# Altium project Arduino.PrjPcb (part 1 of 3)
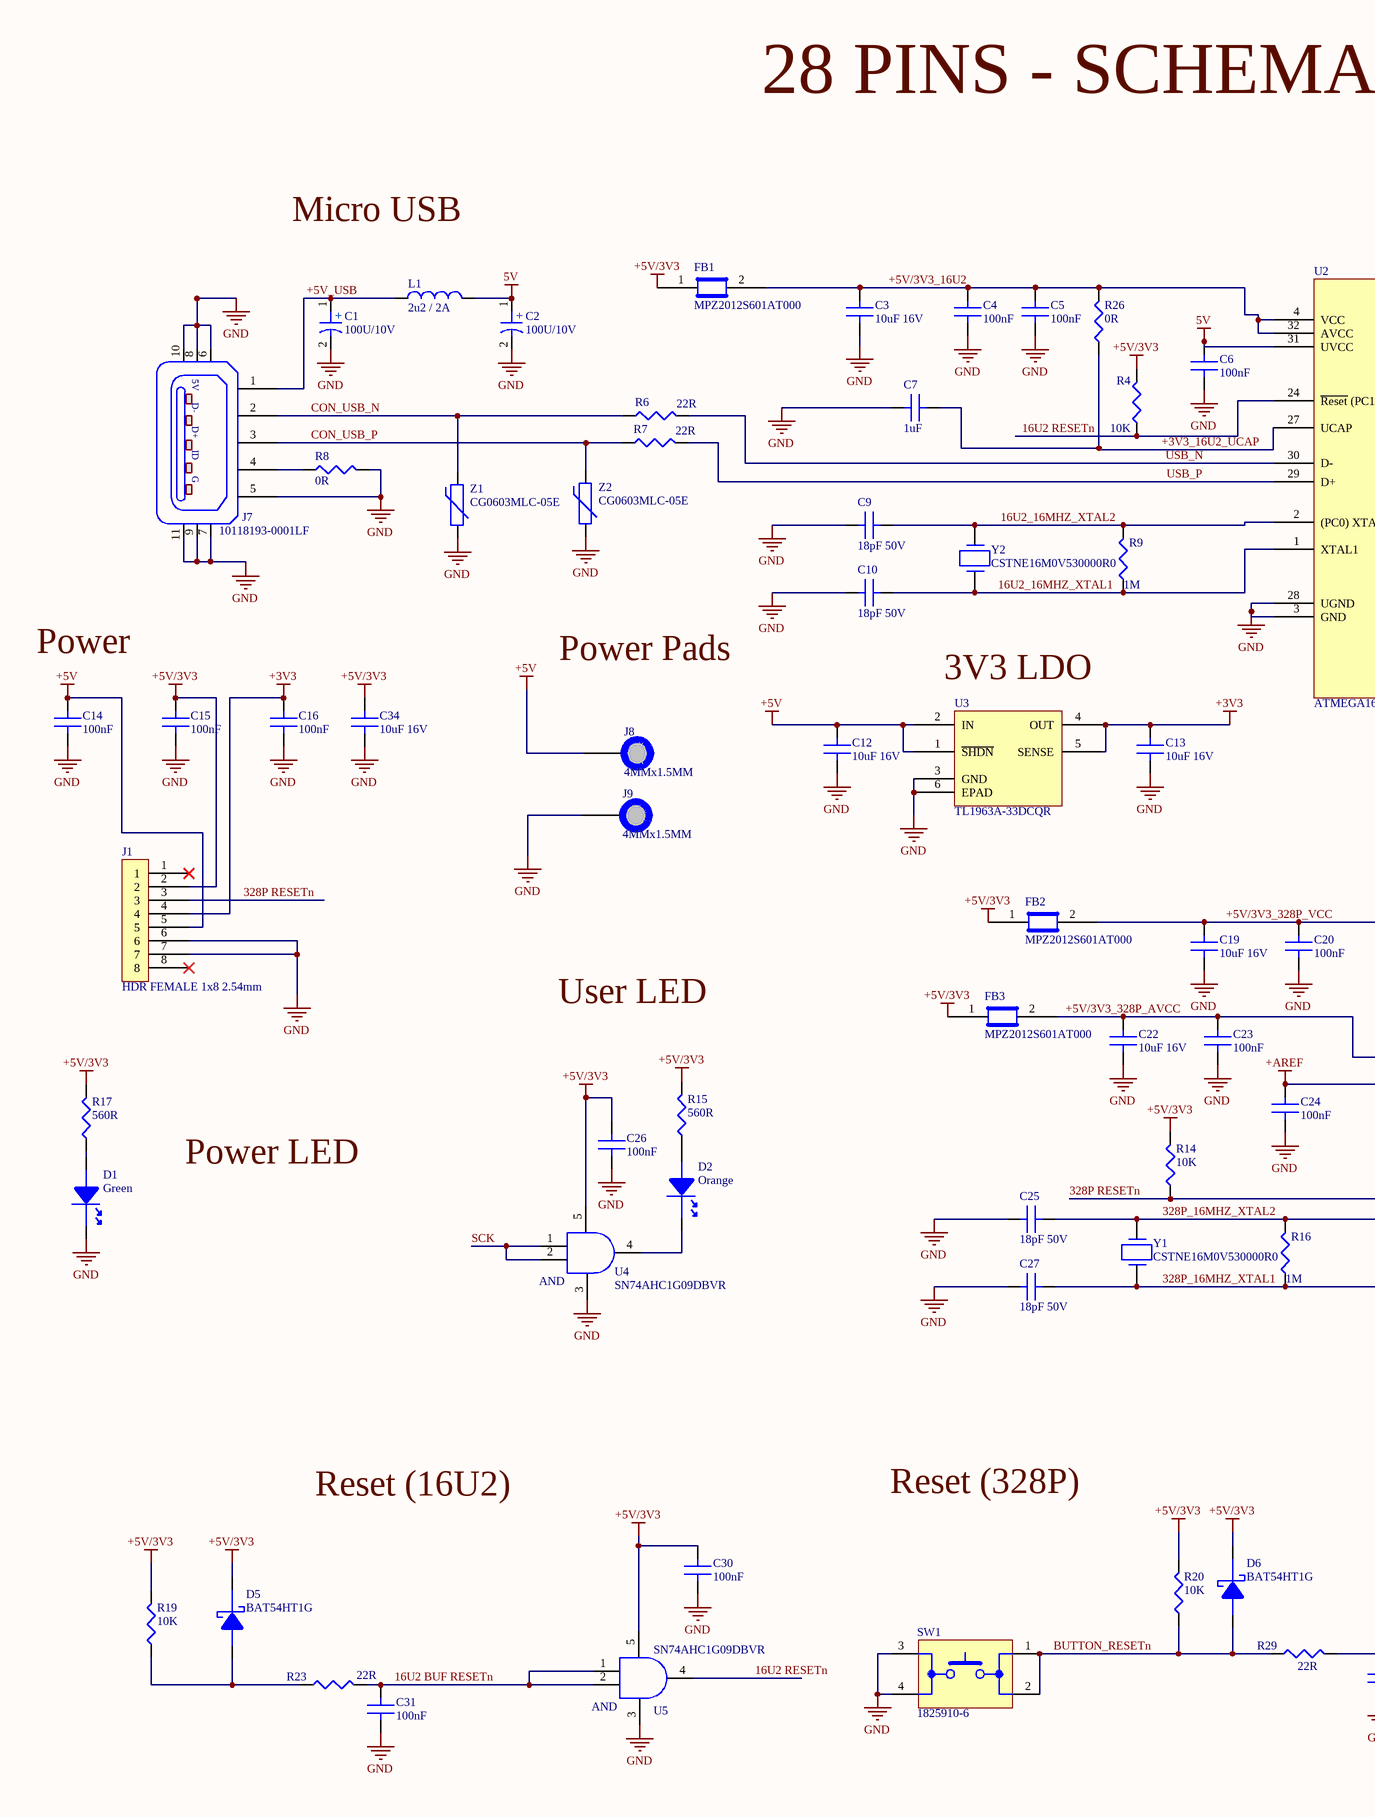
[diagram p0: Arduino_Schematic.SchDoc, left]
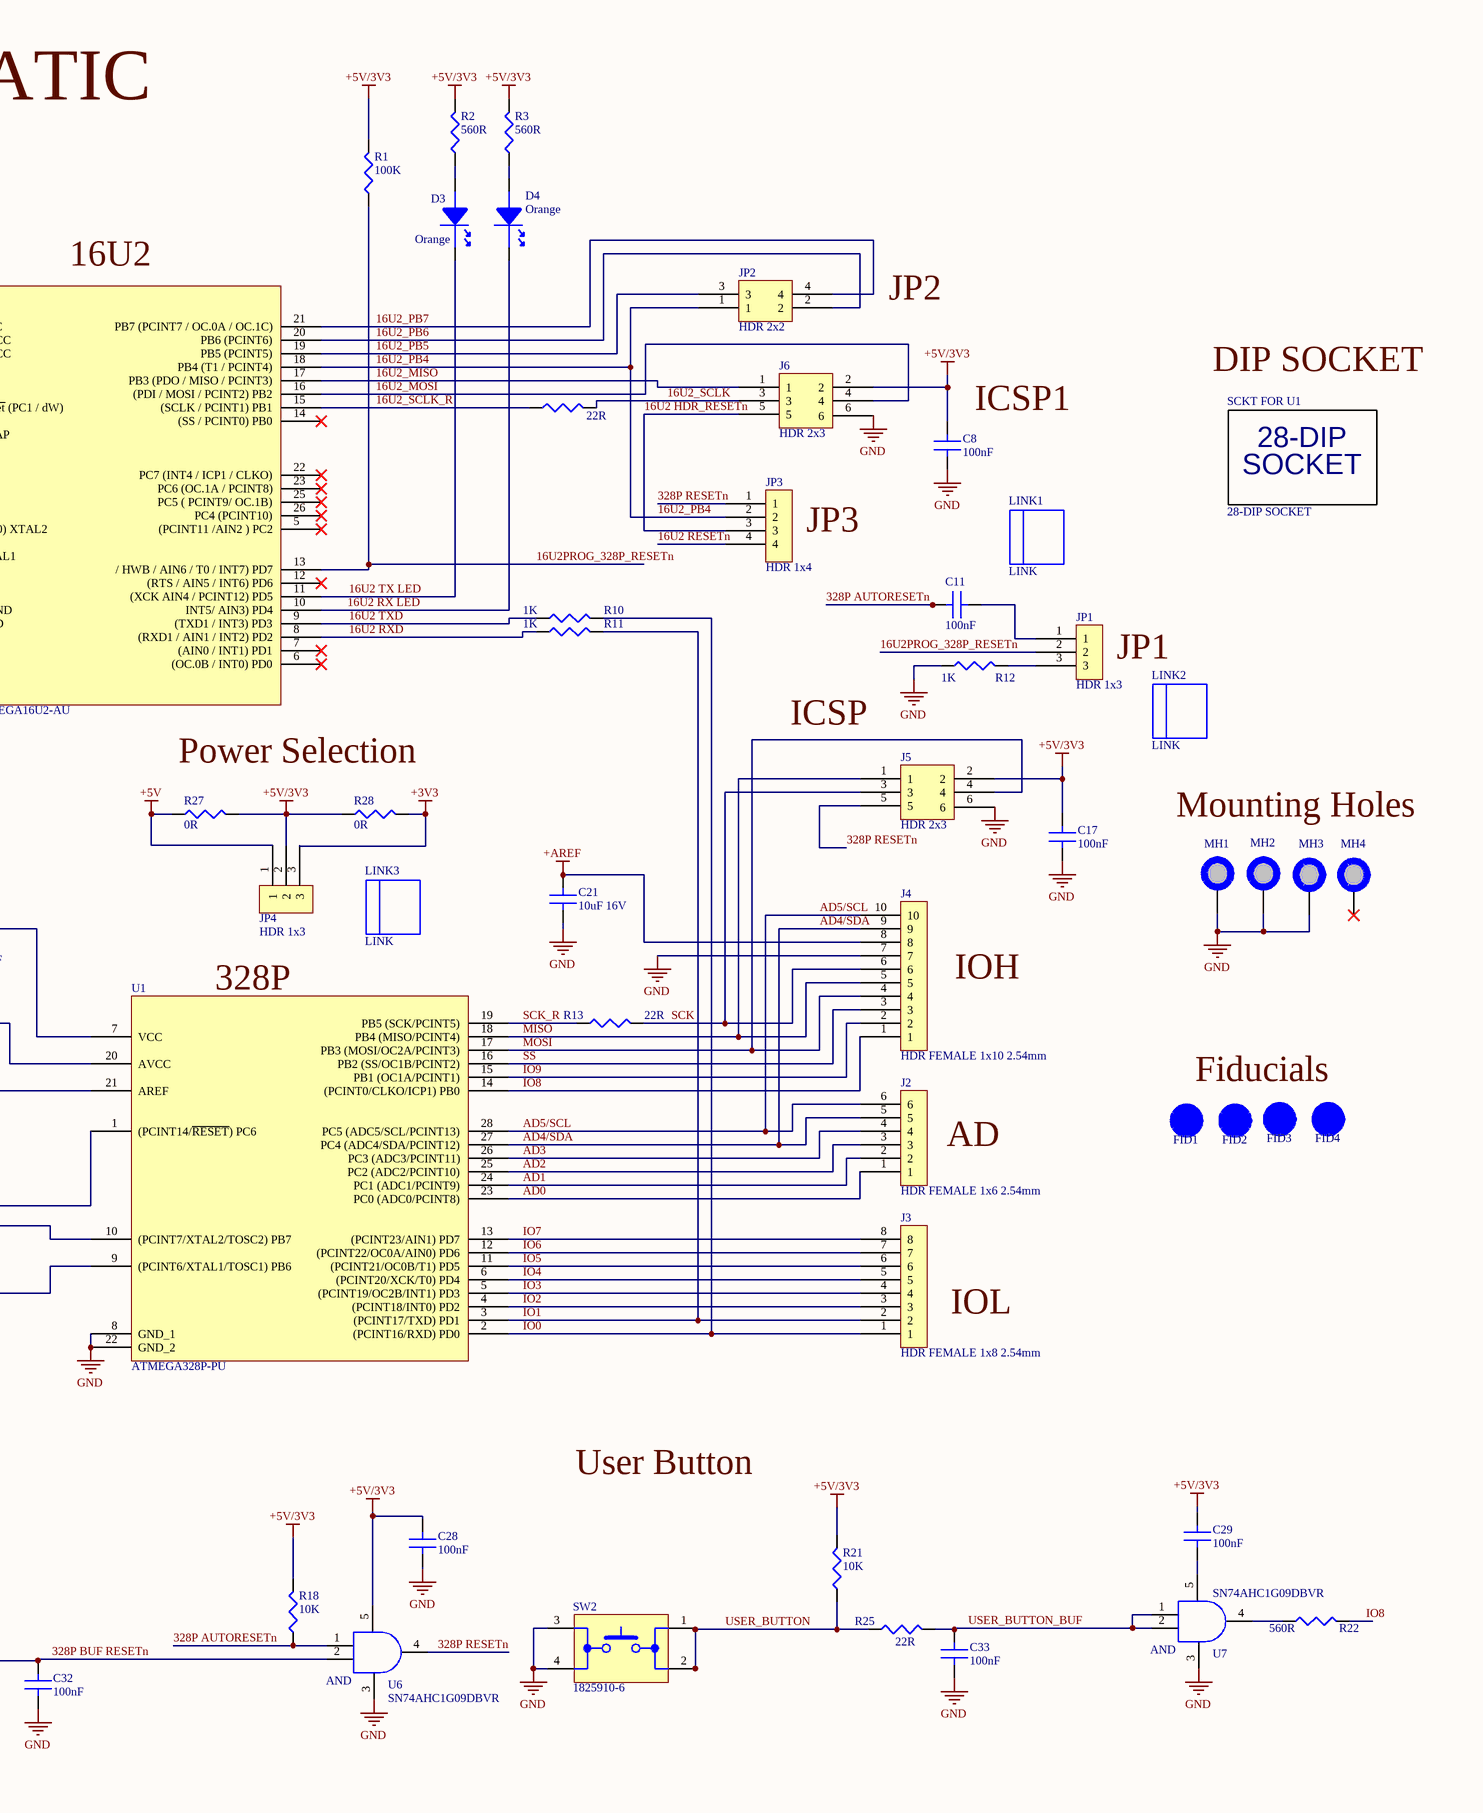
[diagram p1: Arduino_Schematic.SchDoc, right]
NotFitted: NF; Title: Arduino
1 sheet, 109 parts. Net scope: global (net labels, ports and power ports of the same name join across sheets).

## Sheet Arduino_Schematic.SchDoc: Arduino
size A2; SheetNumber: 1; SheetTotal: 1

### Parts
C1  100U/10V  [C_ALUE_C_SIZE]
C2  100U/10V  [C_ALUE_C_SIZE]
C3  10uF 16V  [C0805]
C4  100nF  [C0805]
C5  100nF  [C0805]
C6  100nF  [C0805]
C7  1uF  [C0805]
C8  100nF  [C0805]
C9  18pF 50V  [C0805]
C10  18pF 50V  [C0805]
C11  100nF  [C0805]
C12  10uF 16V  [C0805]
C13  10uF 16V  [C0805]
C14  100nF  [C0805]
C15  100nF  [C0805]
C16  100nF  [C0805]
C17  100nF  [C0805]
C19  10uF 16V  [C0805]
C20  100nF  [C0805]
C21  10uF 16V  [C0805]
C22  10uF 16V  [C0805]
C23  100nF  [C0805]
C24  100nF  [C0805]
C25  18pF 50V  [C0805]
C26  100nF  [C0805]
C27  18pF 50V  [C0805]
C28  100nF  [C0805]
C29  100nF  [C0805]
C30  100nF  [C0805]
C31  100nF  [C0805]
C32  100nF  [C0805]
C33  100nF  [C0805]
C34  10uF 16V  [C0805]
D1  Green  [LED_0603]
D2  Orange  [LED_0603]
D3  Orange  [LED_0603]
D4  Orange  [LED_0603]
D5  BAT54HT1G  [SOD323]
D6  BAT54HT1G  [SOD323]
FB1  MPZ2012S601AT000  [C0805]
FB2  MPZ2012S601AT000  [C0805]
FB3  MPZ2012S601AT000  [C0805]
FID1  FID_1MM  [FID_40x120D]  (value not drawn)  (no BOM)
FID2  FID_1MM  [FID_40x120D]  (value not drawn)  (no BOM)
FID3  FID_1MM  [FID_40x120D]  (value not drawn)  (no BOM)
FID4  FID_1MM  [FID_40x120D]  (value not drawn)  (no BOM)
J1  HDR FEMALE 1x8 2.54mm  [HDR_FEMALE_1x8_2.54]
J2  HDR FEMALE 1x6 2.54mm  [HDR_FEMALE_1x6_2.54]
J3  HDR FEMALE 1x8 2.54mm  [HDR_FEMALE_1x8_2.54]
J4  HDR FEMALE 1x10 2.54mm  [HDR_FEMALE_1x10_2.54]
J5  HDR 2x3  [HDR 2X3]
J6  HDR 2x3  [HDR 2X3]
J7  10118193-0001LF  [10118193]
J8  4MMx1.5MM  [PAD_WITH_HOLE_4MMx1.5MM]  (no BOM)
J9  4MMx1.5MM  [PAD_WITH_HOLE_4MMx1.5MM]  (no BOM)
JP1  HDR 1x3  [HDR_1x3_2.54]
JP2  HDR 2x2  [HDR 2X2_2.54MM]
JP3  HDR 1x4  [HDR_1x4_2.54]
JP4  HDR 1x3  [HDR_1x3_2.54]
L1  2u2 / 2A  [C1210_IND]
LINK1  LINK  (mechanical)
LINK2  LINK  (mechanical)
LINK3  LINK  (mechanical)
MH1  MH_7.4MMC_3.2MMD  [MH_7.4MMD_3.2MMD]  (value not drawn)  (no BOM)
MH2  MH_7.4MMC_3.2MMD  [MH_7.4MMD_3.2MMD]  (value not drawn)  (no BOM)
MH3  MH_7.4MMC_3.2MMD  [MH_7.4MMD_3.2MMD]  (value not drawn)  (no BOM)
MH4  MH_7.4MMNC_3.2MMD  [MH_7.4MMNC_3.2MMD_NON_COPPER_NPT]  (value not drawn)  (no BOM)
R1  100K  [R0805]
R2  560R  [R0805]
R3  560R  [R0805]
R4  10K  [R0805]
R6  22R  [R0805]
R7  22R  [R0805]
R8  0R  [R0805]
R9  1M  [R0805]
R10  1K  [R0805]
R11  1K  [R0805]
R12  1K  [R0805]
R13  22R  [R0805]
R14  10K  [R0805]
R15  560R  [R0805]
R16  1M  [R0805]
R17  560R  [R0805]
R18  10K  [R0805]
R19  10K  [R0805]
R20  10K  [R0805]
R21  10K  [R0805]
R22  560R  [R0805]
R23  22R  [R0805]
R25  22R  [R0805]
R26  0R  [R0805]
R27  0R  [R0805]
R28  0R  [R0805]
R29  22R  [R0805]
SCKT_FOR_U1  28-DIP SOCKET  [28-DIP_7.62mm_SOCKET]
SW1  1825910-6  [1825910-6]
SW2  1825910-6  [1825910-6]
U1  ATMEGA328P-PU  [28_DIP_7.62]
U2  ATMEGA16U2-AU  [TQFP32]
U3  TL1963A-33DCQR  [3.3V LDO]
U4  SN74AHC1G09DBVR  [DBV_SOT_23_5]
U5  SN74AHC1G09DBVR  [DBV_SOT_23_5]
U6  SN74AHC1G09DBVR  [DBV_SOT_23_5]
U7  SN74AHC1G09DBVR  [DBV_SOT_23_5]
Y1  CSTNE16M0V530000R0  [16MHz Oscillator]
Y2  CSTNE16M0V530000R0  [16MHz Oscillator]
Z1  CG0603MLC-05E  [R0603]
Z2  CG0603MLC-05E  [R0603]
  22R  [R0805]

### Nets
5V: C2.1 C6.2 L1.2 U2.31(UVCC)
+3V3: C13.2 C16.2 J1.4 JP4.3 R28.2 U3.4(OUT) U3.5(SENSE)
+5V: C12.2 C14.2 J1.5 J8.1 JP4.1 R27.1 U3.1(~{SHDN}) U3.2(IN)
+5V/3V3: C8.2 C15.2 C17.2 C26.2 C28.2 C29.2 C30.2 C34.2 D5.1(Cathode) D6.1(Cathode) FB1.1 FB2.1 FB3.1 J1.2 J5.2 J6.2 JP4.2 R1.2 R2.2 R3.2 R4.2 R14.2 R15.2 R17.2 R18.2 R19.2 R20.2 R21.2 R27.2 R28.1 U4.5 U5.5 U6.5
+AREF: C21.2 C24.2 J4.8 U1.21(AREF)
GND: C1.2 C2.2 C3.1 C4.1 C5.1 C6.1 C7.1 C8.1 C9.2 C10.2 C12.1 C13.1 C14.1 C15.1 C16.1 C17.1 C19.1 C20.1 C21.1 C22.1 C23.1 C24.1 C25.2 C26.1 C27.2 C28.1 C30.1 C31.1 C32.1 C33.1 C34.1 D1.1(Cathode) J1.6 J1.7 J4.7 J5.6 J6.6 J7.5 J7.6 J7.7 J7.8 J7.9 J7.10 J7.11 J9.1 MH1.1 MH2.1 MH3.1 R8.2 R12.1 SW1.3 SW1.4 SW2.3 SW2.4 U1.8(GND_1) U1.22(GND_2) U2.3(GND) U2.28(UGND) U3.3(GND) U3.6(EPAD) U4.3 U5.3 U6.3 U7.3 Z1.1 Z2.1
16U2 BUF RESETn: C31.2 R23.2 U5.1 U5.2
16U2 HDR_RESETn: J6.5 JP3.3
16U2 RESETn: JP3.4 R4.1 U2.24(~{Reset}_(PC1_/_dW)) U5.4
16U2 RX LED: D4.1(Cathode) U2.10(INT5/_AIN3)_PD4)
16U2 RXD: R11.1 U2.8((RXD1_/_AIN1_/_INT2)_PD2)
16U2 TX LED: D3.1(Cathode) U2.11((XCK_AIN4_/_PCINT12)_PD5)
16U2 TXD: R10.1 U2.9((TXD1_/_INT3)_PD3)
16U2_16MHZ_XTAL1: C10.1 R9.1 U2.1(XTAL1) Y2.1
16U2_16MHZ_XTAL2: C9.1 R9.2 U2.2((PC0)_XTAL2) Y2.2
16U2_MISO: J6.1 U2.17(PB3_(PDO_/_MISO_/_PCINT3))
16U2_MOSI: J6.4 U2.16((PDI_/_MOSI_/_PCINT2)_PB2)
16U2_PB4: JP2.1 JP3.2 U2.18(PB4_(T1_/_PCINT4))
16U2_PB5: JP2.3 U2.19(PB5_(PCINT5))
16U2_PB6: JP2.2 U2.20(PB6_(PCINT6))
16U2_PB7: JP2.4 U2.21(PB7_(PCINT7_/_OC.0A_/_OC.1C))
16U2_SCLK: J6.3 .2
16U2_SCLK_R: U2.15((SCLK_/_PCINT1)_PB1) .1
16U2PROG_328P_RESETn: JP1.2 R1.1 U2.13(/_HWB_/_AIN6_/_T0_/_INT7)_PD7)
328P AUTORESETn: C11.1 R18.1 U6.1
328P BUF RESETn: C32.2 R29.2 U6.2
328P RESETn: J1.3 J5.5 JP3.1 R14.1 U1.1((PCINT14/~{RESET})_PC6) U6.4
328P_16MHZ_XTAL1: C27.1 R16.1 U1.9((PCINT6/XTAL1/TOSC1)_PB6) Y1.1
328P_16MHZ_XTAL2: C25.1 R16.2 U1.10((PCINT7/XTAL2/TOSC2)_PB7) Y1.2
+3V3_16U2_UCAP: C7.2 R26.1 U2.27(UCAP)
+5V/3V3_16U2: C3.2 C4.2 C5.2 FB1.2 R26.2 U2.4(VCC) U2.32(AVCC)
+5V/3V3_328P_AVCC: C22.2 C23.2 FB3.2 U1.20(AVCC)
+5V/3V3_328P_VCC: C19.2 C20.2 FB2.2 U1.7(VCC)
+5V_USB: C1.1 J7.1 L1.1
AD0: J2.1 U1.23(PC0_(ADC0/PCINT8))
AD1: J2.2 U1.24(PC1_(ADC1/PCINT9))
AD2: J2.3 U1.25(PC2_(ADC2/PCINT10))
AD3: J2.4 U1.26(PC3_(ADC3/PCINT11))
AD4/SDA: J2.5 J4.9 U1.27(PC4_(ADC4/SDA/PCINT12))
AD5/SCL: J2.6 J4.10 U1.28(PC5_(ADC5/SCL/PCINT13))
BUTTON_RESETn: D6.2(Anode) R20.1 R29.1 SW1.1 SW1.2
CON_USB_N: J7.2 R6.1 Z1.2
CON_USB_P: J7.3 R7.1 Z2.2
IO0: J3.1 R10.2 U1.2((PCINT16/RXD)_PD0)
IO1: J3.2 R11.2 U1.3((PCINT17/TXD)_PD1)
IO2: J3.3 U1.4((PCINT18/INT0)_PD2)
IO3: J3.4 U1.5((PCINT19/OC2B/INT1)_PD3)
IO4: J3.5 U1.6((PCINT20/XCK/T0)_PD4)
IO5: J3.6 U1.11((PCINT21/OC0B/T1)_PD5)
IO6: J3.7 U1.12((PCINT22/OC0A/AIN0)_PD6)
IO7: J3.8 U1.13((PCINT23/AIN1)_PD7)
IO8: J4.1 R22.2 U1.14((PCINT0/CLKO/ICP1)_PB0)
IO9: J4.2 U1.15(PB1_(OC1A/PCINT1))
MISO: J4.5 J5.1 U1.18(PB4_(MISO/PCINT4))
MOSI: J4.4 J5.4 U1.17(PB3_(MOSI/OC2A/PCINT3))
SCK: J4.6 J5.3 R13.2 U4.1 U4.2
SCK_R: R13.1 U1.19(PB5_(SCK/PCINT5))
SS: J4.3 U1.16(PB2_(SS/OC1B/PCINT2))
USB_N: R6.2 U2.30(D-)
USB_P: R7.2 U2.29(D+)
USER_BUTTON: R21.1 R25.1 SW2.1 SW2.2
USER_BUTTON_BUF: C33.2 R25.2 U7.1 U7.2
NetC11_2: C11.2 JP1.1
NetC29_1: C29.1 U7.5
NetD1_2: D1.2(Anode) R17.1
NetD2_1: D2.1(Cathode) U4.4
NetD2_2: D2.2(Anode) R15.1
NetD3_2: D3.2(Anode) R2.1
NetD4_2: D4.2(Anode) R3.1
NetD5_2: D5.2(Anode) R19.1 R23.1
NetJ7_4: J7.4 R8.1
NetJP1_3: JP1.3 R12.2
NetR22_1: R22.1 U7.4

Not connected (* = marked no-connect by the designer): J1 1* 8*; MH4 1*; U2 5((PCINT11_/AIN2_)_PC2)* 6((OC.0B_/_INT0)_PD0)* 7((AIN0_/_INT1)_PD1)* 12((RTS_/_AIN5_/_INT6)_PD6)* 14((SS_/_PCINT0)_PB0)* 22(PC7_(INT4_/_ICP1_/_CLKO))* 23(PC6_(OC.1A_/_PCINT8))* 25(PC5_(_PCINT9/_OC.1B))* 26(PC4_(PCINT10))*

### Notes on the sheet
- 28 PINS - SCHEMATIC
- Micro USB
- (near U2) 16U2
- JP2
- (near C8) ICSP1
- DIP SOCKET
- (near JP3) JP3
- Power
- Power Pads
- JP1
- (near U3) 3V3 LDO
- ICSP
- Power Selection
- Mounting Holes
- User LED
- (near U1) 328P
- IOH
- Fiducials
- (near J2) AD
- Power LED
- (near J3) IOL
- User Button
- Reset (16U2)
- Reset (328P)
- (in symbol 4828-3004-CP) 28-DIP; SOCKET
- (in symbol 10118193-0001LF) 5V; D-; D+; ID; G
- (in symbol EEE-1AA101WR) +
- (in symbol SN74AHC1G09DBVR) AND